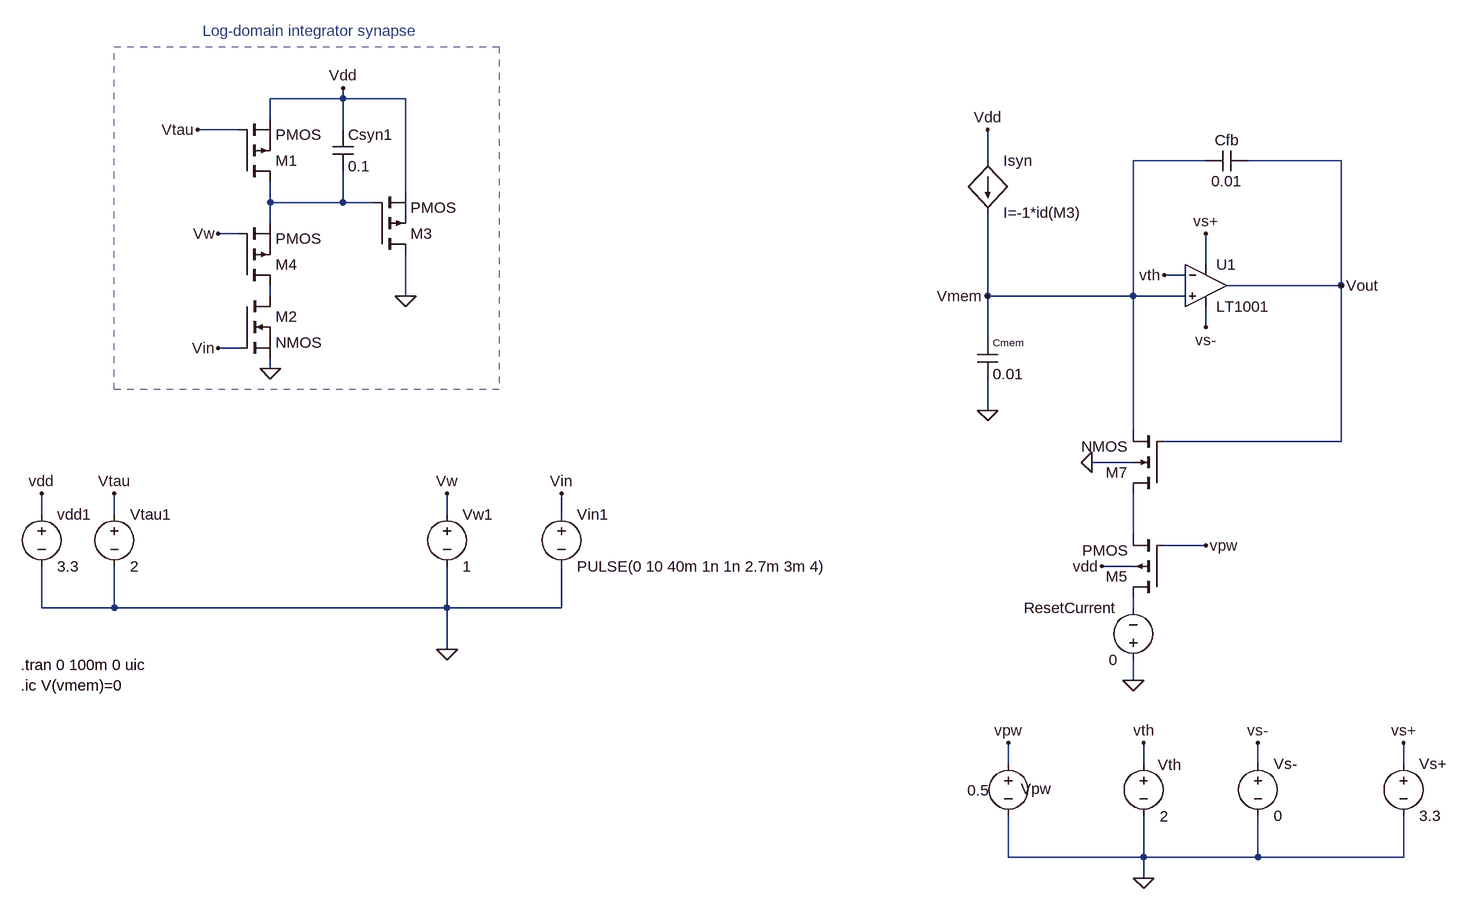
[diagram p0: schematic mmn13_q4_subC.asc]
mmn13_q4_subC.asc, the LTspice schematic file:
Version 4.1
SHEET 1 2520 948
WIRE 160 -272 160 -288
WIRE 160 -272 48 -272
WIRE 256 -272 160 -272
WIRE 48 -240 48 -272
WIRE 0 -224 -64 -224
WIRE 160 -224 160 -272
WIRE 1152 -176 1152 -224
WIRE 1488 -176 1376 -176
WIRE 1696 -176 1552 -176
WIRE 256 -128 256 -272
WIRE 48 -112 48 -144
WIRE 160 -112 160 -160
WIRE 160 -112 48 -112
WIRE 208 -112 160 -112
WIRE 48 -80 48 -112
WIRE 0 -64 -32 -64
WIRE 1488 -16 1488 -64
WIRE 1456 0 1424 0
WIRE 1696 16 1696 -176
WIRE 1696 16 1520 16
WIRE 48 32 48 16
WIRE 256 32 256 -32
WIRE 1152 32 1152 -96
WIRE 1376 32 1376 -176
WIRE 1376 32 1152 32
WIRE 1456 32 1376 32
WIRE 1488 80 1488 48
WIRE 1152 96 1152 32
WIRE 0 112 -32 112
WIRE 48 144 48 128
WIRE 1152 208 1152 160
WIRE 1376 240 1376 32
WIRE 1696 256 1696 16
WIRE 1696 256 1424 256
WIRE 1376 288 1312 288
WIRE -304 368 -304 336
WIRE -192 368 -192 336
WIRE 320 368 320 336
WIRE 496 368 496 336
WIRE 1376 400 1376 336
WIRE 1488 416 1424 416
WIRE 1376 448 1328 448
WIRE -304 512 -304 448
WIRE -192 512 -192 448
WIRE -192 512 -304 512
WIRE 320 512 320 448
WIRE 320 512 -192 512
WIRE 496 512 496 448
WIRE 496 512 320 512
WIRE 1376 512 1376 496
WIRE 320 576 320 512
WIRE 1376 624 1376 592
WIRE 1184 752 1184 720
WIRE 1392 752 1392 720
WIRE 1568 752 1568 720
WIRE 1792 752 1792 720
WIRE 1184 896 1184 832
WIRE 1392 896 1392 832
WIRE 1392 896 1184 896
WIRE 1568 896 1568 832
WIRE 1568 896 1392 896
WIRE 1792 896 1792 832
WIRE 1792 896 1568 896
WIRE 1392 928 1392 896
FLAG 1152 208 0
FLAG 1328 448 vdd
FLAG 1312 288 0
FLAG 1184 720 vpw
FLAG 1392 720 vth
FLAG 1568 720 vs-
FLAG 1792 720 vs+
FLAG 1424 0 vth
FLAG 1488 80 vs-
FLAG 1488 -64 vs+
FLAG 1392 928 0
FLAG 1488 416 vpw
FLAG 1152 32 Vmem
FLAG 1376 624 0
FLAG 1696 16 Vout
FLAG -32 112 Vin
FLAG -32 -64 Vw
FLAG -64 -224 Vtau
FLAG 160 -288 Vdd
FLAG 48 144 0
FLAG 496 336 Vin
FLAG 320 336 Vw
FLAG -192 336 Vtau
FLAG 320 576 0
FLAG -304 336 vdd
FLAG 256 32 0
FLAG 1152 -224 Vdd
SYMBOL voltage 1792 736 R0
SYMATTR InstName Vs+
SYMATTR Value 3.3
SYMBOL voltage 1568 736 R0
SYMATTR InstName Vs-
SYMATTR Value 0
SYMBOL voltage 1392 736 R0
WINDOW 0 40 2 Top 2
WINDOW 3 32 81 Top 2
WINDOW 123 0 0 Left 0
WINDOW 39 0 0 Left 0
SYMATTR InstName Vth
SYMATTR Value 2
SYMBOL cap 1136 96 R0
WINDOW 0 24 8 Left 1
SYMATTR InstName Cmem
SYMATTR Value 0.01 
SYMBOL voltage 1184 736 R0
WINDOW 0 19 55 Left 2
WINDOW 3 -46 41 Top 2
WINDOW 123 0 0 Left 0
WINDOW 39 0 0 Left 0
SYMATTR InstName Vpw
SYMATTR Value 0.5
SYMBOL nmos4 1424 336 R180
SYMATTR InstName M7
SYMBOL pmos4 1424 496 R180
SYMATTR InstName M5
SYMBOL LT1001 1488 -48 R0
SYMATTR InstName U1
SYMBOL cap 1488 -160 R270
WINDOW 0 32 32 VTop 2
WINDOW 3 0 32 VBottom 2
SYMATTR InstName Cfb
SYMATTR Value 0.01 
SYMBOL voltage 1376 608 R180
WINDOW 0 24 96 Left 2
WINDOW 3 24 16 Left 2
SYMATTR InstName ResetCurrent
SYMATTR Value 0
SYMBOL cap 144 -224 R0
SYMATTR InstName Csyn1
SYMATTR Value 0.1 
SYMBOL pmos 0 -144 M180
SYMATTR InstName M1
SYMBOL nmos 0 32 R0
SYMATTR InstName M2
SYMBOL pmos 208 -32 M180
SYMATTR InstName M3
SYMBOL pmos 0 16 M180
SYMATTR InstName M4
SYMBOL voltage 496 352 R0
WINDOW 123 0 0 Left 0
WINDOW 39 0 0 Left 0
SYMATTR InstName Vin1
SYMATTR Value PULSE(0 10 40m 1n 1n 2.7m 3m 4)
SYMBOL voltage 320 352 R0
WINDOW 123 0 0 Left 0
WINDOW 39 0 0 Left 0
SYMATTR InstName Vw1
SYMATTR Value 1
SYMBOL voltage -192 352 R0
WINDOW 123 0 0 Left 0
WINDOW 39 0 0 Left 0
SYMATTR InstName Vtau1
SYMATTR Value 2
SYMBOL voltage -304 352 R0
SYMATTR InstName vdd1
SYMATTR Value 3.3
SYMBOL bi 1152 -176 R0
SYMATTR InstName Isyn
SYMATTR Value I=-1*id(M3)
TEXT -56 -376 Left 2 ;Log-domain integrator synapse
TEXT -336 600 Left 2 !.tran 0 100m 0 uic\n.ic V(vmem)=0
RECTANGLE Normal 400 176 -192 -352 2

The netlist it stands for:
* mmn13_q4_subC.asc
Vs+ vs+ 0 3.3
Vs- vs- 0 0
Vth vth 0 2
Cmem Vmem 0 0.01
Vpw vpw 0 0.5
M7 N003 Vout Vmem 0 NMOS
M5 N004 vpw N003 vdd PMOS
X§U1 Vmem vth vs+ vs- Vout LT1001  ; pins In+ In- V+ V- OUT
Cfb Vmem Vout 0.01
V§ResetCurrent 0 N004 0
Csyn1 vdd N001 0.1
M1 N001 Vtau vdd vdd PMOS
M2 N002 Vin 0 0 NMOS
M3 0 N001 vdd vdd PMOS
M4 N002 Vw N001 N001 PMOS
Vin1 Vin 0 PULSE(0 10 40m 1n 1n 2.7m 3m 4)
Vw1 Vw 0 1
Vtau1 Vtau 0 2
vdd1 vdd 0 3.3
B§Isyn vdd Vmem I=-1*id(M3)
.model NMOS NMOS
.model PMOS PMOS
.lib standard.mos
* Log-domain integrator synapse
.tran 0 100m 0 uic
.ic V(vmem)=0
.lib LTC.lib
.backanno
.end